# Altium schematic sheet FPGA_Decoupling.SchDoc: Sayma AMC
size 420 x 297 mm; $$Internal___BlkDate: 0:12:25_2-9-18; $$Internal_NAME_PLACEHOLDER: a3sheet; $$Internal_Resolution: 00001mm; $$NotCommonProperty_@NAME: FPGA_XCKU040FFVA1156; $$NotCommonProperty_@PRINTORDER: 24; $$NotCommonProperty_@SHEET: FPGA Decoupling; $$NotCommonProperty_@SHEETTOTAL: 30; CmpIndex: 996; Drawing Author: G.Kasprowicz; Drawing Number: Sayma AMC; Drawing Project: AMC FMC Carrier Board; Drawing Revision: 2.0; SymIndex: 2141; CheckedBy: P.Kulik,T.Przywozki,W.Ruclo; Author: G.Kasprowicz; CompanyName: WUT ISE; DrawnBy: G.Kasprowicz; Organization: WUT ISE; Address1: PW ISE; Address2: Nowowiejska 15/19 00-665 Warsaw; Address3: gkasprow@gmail.com; DocumentNumber: 30; Revision: 2; SheetNumber: 30; SheetTotal: 32; ModifiedBy: -; CheckedDate: -; Title2: FPGA Decoupling; DivGrp: WUT ISE; Designer: G.Kasprowicz; ModifiedDate: -; ProjectName: Sensor Box
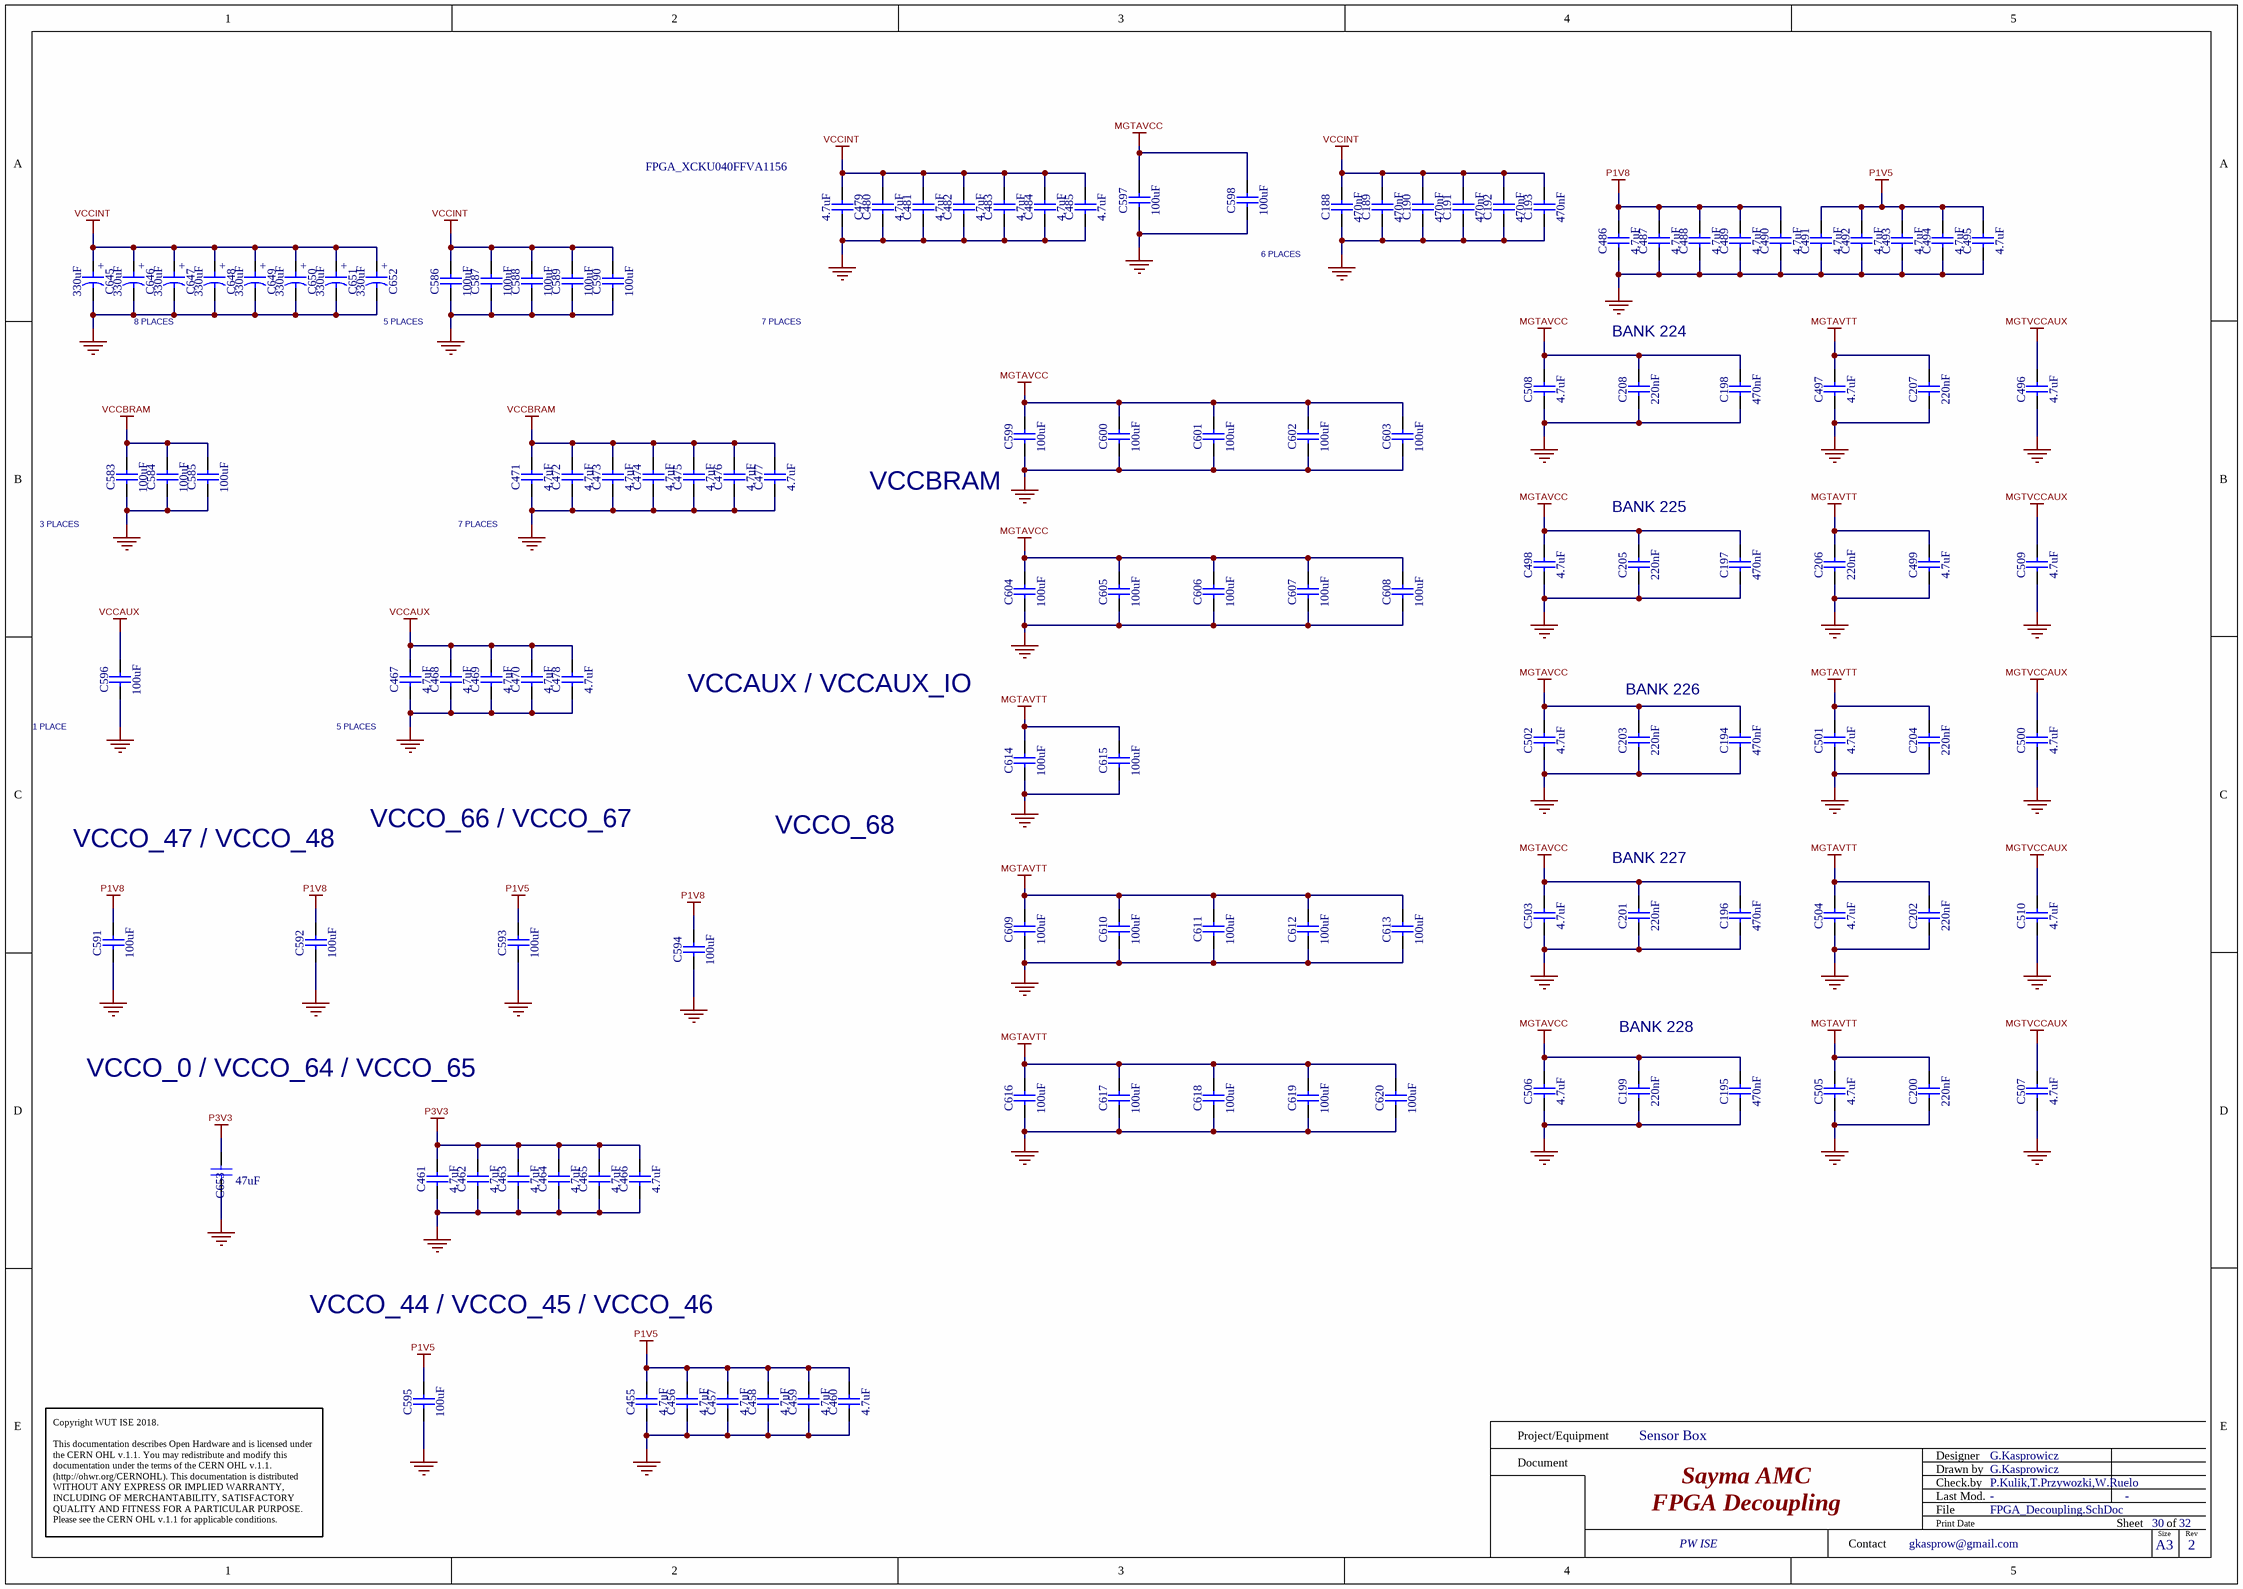
[diagram p0: FPGA_Decoupling.SchDoc]

## Parts
C188  470nF  [CAPC0603X33N]
C189  470nF  [CAPC0603X33N]
C190  470nF  [CAPC0603X33N]
C191  470nF  [CAPC0603X33N]
C192  470nF  [CAPC0603X33N]
C193  470nF  [CAPC0603X33N]
C194  470nF  [CAPC0603X33N]
C195  470nF  [CAPC0603X33N]
C196  470nF  [CAPC0603X33N]
C197  470nF  [CAPC0603X33N]
C198  470nF  [CAPC0603X33N]
C199  220nF  [CAPC0603X33N]
C200  220nF  [CAPC0603X33N]
C201  220nF  [CAPC0603X33N]
C202  220nF  [CAPC0603X33N]
C203  220nF  [CAPC0603X33N]
C204  220nF  [CAPC0603X33N]
C205  220nF  [CAPC0603X33N]
C206  220nF  [CAPC0603X33N]
C207  220nF  [CAPC0603X33N]
C208  220nF  [CAPC0603X33N]
C455  4.7uF  [CAPC1005X55N]
C456  4.7uF  [CAPC1005X55N]
C457  4.7uF  [CAPC1005X55N]
C458  4.7uF  [CAPC1005X55N]
C459  4.7uF  [CAPC1005X55N]
C460  4.7uF  [CAPC1005X55N]
C461  4.7uF  [CAPC1005X55N]
C462  4.7uF  [CAPC1005X55N]
C463  4.7uF  [CAPC1005X55N]
C464  4.7uF  [CAPC1005X55N]
C465  4.7uF  [CAPC1005X55N]
C466  4.7uF  [CAPC1005X55N]
C467  4.7uF  [CAPC1005X55N]
C468  4.7uF  [CAPC1005X55N]
C469  4.7uF  [CAPC1005X55N]
C470  4.7uF  [CAPC1005X55N]
C471  4.7uF  [CAPC1005X55N]
C472  4.7uF  [CAPC1005X55N]
C473  4.7uF  [CAPC1005X55N]
C474  4.7uF  [CAPC1005X55N]
C475  4.7uF  [CAPC1005X55N]
C476  4.7uF  [CAPC1005X55N]
C477  4.7uF  [CAPC1005X55N]
C478  4.7uF  [CAPC1005X55N]
C479  4.7uF  [CAPC1005X55N]
C480  4.7uF  [CAPC1005X55N]
C481  4.7uF  [CAPC1005X55N]
C482  4.7uF  [CAPC1005X55N]
C483  4.7uF  [CAPC1005X55N]
C484  4.7uF  [CAPC1005X55N]
C485  4.7uF  [CAPC1005X55N]
C486  4.7uF  [CAPC1005X55N]
C487  4.7uF  [CAPC1005X55N]
C488  4.7uF  [CAPC1005X55N]
C489  4.7uF  [CAPC1005X55N]
C490  4.7uF  [CAPC1005X55N]
C491  4.7uF  [CAPC1005X55N]
C492  4.7uF  [CAPC1005X55N]
C493  4.7uF  [CAPC1005X55N]
C494  4.7uF  [CAPC1005X55N]
C495  4.7uF  [CAPC1005X55N]
C496  4.7uF  [CAPC1005X55N]
C497  4.7uF  [CAPC1005X55N]
C498  4.7uF  [CAPC1005X55N]
C499  4.7uF  [CAPC1005X55N]
C500  4.7uF  [CAPC1005X55N]
C501  4.7uF  [CAPC1005X55N]
C502  4.7uF  [CAPC1005X55N]
C503  4.7uF  [CAPC1005X55N]
C504  4.7uF  [CAPC1005X55N]
C505  4.7uF  [CAPC1005X55N]
C506  4.7uF  [CAPC1005X55N]
C507  4.7uF  [CAPC1005X55N]
C508  4.7uF  [CAPC1005X55N]
C509  4.7uF  [CAPC1005X55N]
C510  4.7uF  [CAPC1005X55N]
C583  100uF  [CAPC3216X180N]
C584  100uF  [CAPC3216X180N]
C585  100uF  [CAPC3216X180N]
C586  100uF  [CAPC3216X180N]
C587  100uF  [CAPC3216X180N]
C588  100uF  [CAPC3216X180N]
C589  100uF  [CAPC3216X180N]
C590  100uF  [CAPC3216X180N]
C591  100uF  [CAPC3216X180N]
C592  100uF  [CAPC3216X180N]
C593  100uF  [CAPC3216X180N]
C594  100uF  [CAPC3216X180N]
C595  100uF  [CAPC3216X180N]
C596  100uF  [CAPC3216X180N]
C597  100uF  [CAPC3216X180N]
C598  100uF  [CAPC3216X180N]
C599  100uF  [CAPC3216X180N]
C600  100uF  [CAPC3216X180N]
C601  100uF  [CAPC3216X180N]
C602  100uF  [CAPC3216X180N]
C603  100uF  [CAPC3216X180N]
C604  100uF  [CAPC3216X180N]
C605  100uF  [CAPC3216X180N]
C606  100uF  [CAPC3216X180N]
C607  100uF  [CAPC3216X180N]
C608  100uF  [CAPC3216X180N]
C609  100uF  [CAPC3216X180N]
C610  100uF  [CAPC3216X180N]
C611  100uF  [CAPC3216X180N]
C612  100uF  [CAPC3216X180N]
C613  100uF  [CAPC3216X180N]
C614  100uF  [CAPC3216X180N]
C615  100uF  [CAPC3216X180N]
C616  100uF  [CAPC3216X180N]
C617  100uF  [CAPC3216X180N]
C618  100uF  [CAPC3216X180N]
C619  100uF  [CAPC3216X180N]
C620  100uF  [CAPC3216X180N]
C645  330uF  [CAPMP3528X210N]
C646  330uF  [CAPMP3528X210N]
C647  330uF  [CAPMP3528X210N]
C648  330uF  [CAPMP3528X210N]
C649  330uF  [CAPMP3528X210N]
C650  330uF  [CAPMP3528X210N]
C651  330uF  [CAPMP3528X210N]
C652  330uF  [CAPMP3528X210N]
C653  47uF  [CAPC3225X270N]

## Nets
GND: C188.1 C189.1 C190.1 C191.1 C192.1 C193.1 C194.1 C195.1 C196.1 C197.1 C198.1 C199.1 C200.1 C201.1 C202.1 C203.1 C204.1 C205.1 C206.1 C207.1 C208.1 C455.1 C456.1 C457.1 C458.1 C459.1 C460.1 C461.1 C462.1 C463.1 C464.1 C465.1 C466.1 C467.1 C468.1 C469.1 C470.1 C471.1 C472.1 C473.1 C474.1 C475.1 C476.1 C477.1 C478.1 C479.1 C480.1 C481.1 C482.1 C483.1 C484.1 C485.1 C486.1 C487.1 C488.1 C489.1 C490.1 C491.1 C492.1 C493.1 C494.1 C495.1 C496.1 C497.1 C498.1 C499.1 C500.1 C501.1 C502.1 C503.1 C504.1 C505.1 C506.1 C507.1 C508.1 C509.1 C510.1 C583.1 C584.1 C585.1 C586.1 C587.1 C588.1 C589.1 C590.1 C591.1 C592.1 C593.1 C594.1 C595.1 C596.1 C597.1 C598.1 C599.1 C600.1 C601.1 C602.1 C603.1 C604.1 C605.1 C606.1 C607.1 C608.1 C609.1 C610.1 C611.1 C612.1 C613.1 C614.1 C615.1 C616.1 C617.1 C618.1 C619.1 C620.1 C645.2 C646.2 C647.2 C648.2 C649.2 C650.2 C651.2 C652.2 C653.1
MGTAVCC: C194.2 C195.2 C196.2 C197.2 C198.2 C199.2 C201.2 C203.2 C205.2 C208.2 C498.2 C502.2 C503.2 C506.2 C508.2 C597.2 C598.2 C599.2 C600.2 C601.2 C602.2 C603.2 C604.2 C605.2 C606.2 C607.2 C608.2
MGTAVTT: C200.2 C202.2 C204.2 C206.2 C207.2 C497.2 C499.2 C501.2 C504.2 C505.2 C609.2 C610.2 C611.2 C612.2 C613.2 C614.2 C615.2 C616.2 C617.2 C618.2 C619.2 C620.2
MGTVCCAUX: C496.2 C500.2 C507.2 C509.2 C510.2
P1V5: C455.2 C456.2 C457.2 C458.2 C459.2 C460.2 C491.2 C492.2 C493.2 C494.2 C495.2 C593.2 C595.2
P1V8: C486.2 C487.2 C488.2 C489.2 C490.2 C591.2 C592.2 C594.2
P3V3: C461.2 C462.2 C463.2 C464.2 C465.2 C466.2 C653.2
VCCAUX: C467.2 C468.2 C469.2 C470.2 C478.2 C596.2
VCCBRAM: C471.2 C472.2 C473.2 C474.2 C475.2 C476.2 C477.2 C583.2 C584.2 C585.2
VCCINT: C188.2 C189.2 C190.2 C191.2 C192.2 C193.2 C479.2 C480.2 C481.2 C482.2 C483.2 C484.2 C485.2 C586.2 C587.2 C588.2 C589.2 C590.2 C645.1 C646.1 C647.1 C648.1 C649.1 C650.1 C651.1 C652.1

## Notes on the sheet
- 6 PLACES
- 8 PLACES
- 5 PLACES
- 7 PLACES
- (near C208) BANK 224
- 3 PLACES
- VCCBRAM
- (near C205) BANK 225
- 1 PLACE
- VCCAUX / VCCAUX_IO
- (near C203) BANK 226
- VCCO_47 / VCCO_48
- VCCO_66 / VCCO_67
- VCCO_68
- (near C201) BANK 227
- (near C199) BANK 228
- VCCO_0 / VCCO_64 / VCCO_65
- VCCO_44 / VCCO_45 / VCCO_46
- Project/Equipment
- Document
- Designer
- Drawn by
- Check.by
- Copyright WUT ISE 2018.
  This documentation describes Open Hardware and is licensed under the CERN OHL v.1.1. You may redistribute and modify this documentation under the terms of the CERN OHL v.1.1. (http://ohwr.org/CERNOHL). This documentation is distributed WITHOUT ANY EXPRESS OR IMPLIED WARRANTY, INCLUDING OF MERCHANTABILITY, SATISFACTORY QUALITY AND FITNESS FOR A PARTICULAR PURPOSE. Please see the CERN OHL v.1.1 for applicable conditions.
- Contact
- File
- Last Mod.
- Print Date
- Sheet
- Size
- A3
- of
- Rev
- (in symbol CTE3528-21_330UF_2.5V_20%_LESR0015_KEMET_T520) +

## Library data of the parts
C188-C198 = CC0201_470NF_4V_20%_X5R: Non-polarised capacitor; Manufacturer: GENERIC; Part Description: SMD Multilayer Chip Ceramic Capacitor; Manufacturer1 Part Number: AMK063BJ474MP-F; Tolerance: ±20%; Voltage: 4V; TC: X5R; Manufacturer Part Number: CC0201_470NF_4V_20%_X5R; Part Number: CC0201_470NF_4V_20%_X5R; Value: 470nF; Component Kind: Standard; Component Type: Standard; Pin Count: 2; Status: Not Recommended; Case: 0201; Mounted: Yes; Socket: No; SMD: Yes; Sense: No; Manufacturer1 Example: TAIYO YUDEN; Manufacturer1 ComponentHeight: 0.33mm; HelpURL: \\cern.ch\dfs\Applications\Altium\Datasheets\CC0201_X5R_TAIYO-YUDEN_STANDARD-CLASS2.pdf; Author: CERN DEM JLC; CreateDate: 27.05.2010; LatestRevisionDate: 27.05.2010
C199-C208 = CC0201_220NF_6.3V_20%_X5R: Non-polarised capacitor; Manufacturer: GENERIC; Part Description: SMD Multilayer Chip Ceramic Capacitor; Manufacturer1 Part Number: JMK063BJ224MP-F; Tolerance: ±20%; Voltage: 6.3V; TC: X5R; Manufacturer Part Number: CC0201_220NF_6.3V_20%_X5R; Part Number: CC0201_220NF_6.3V_20%_X5R; Value: 220nF; Component Kind: Standard; Component Type: Standard; Pin Count: 2; Status: Not Recommended; Case: 0201; Mounted: Yes; Socket: No; SMD: Yes; Sense: No; Manufacturer1 Example: TAIYO YUDEN; Manufacturer1 ComponentHeight: 0.33mm; HelpURL: \\cern.ch\dfs\Applications\Altium\Datasheets\CC0201_X5R_TAIYO-YUDEN_STANDARD-CLASS2.pdf; Author: CERN DEM JLC; CreateDate: 27.05.2010; LatestRevisionDate: 27.05.2010
C455-C510 = CC0402_4.7UF_6.3V_20%_X5R: Non-polarised capacitor; Manufacturer: GENERIC; Part Description: SMD Multilayer Chip Ceramic Capacitor; Manufacturer1 Part Number: C1005X5R0J475M050BC; Tolerance: ±20%; Voltage: 6.3V; TC: X5R; Manufacturer Part Number: CC0402_4.7UF_6.3V_20%_X5R; Part Number: CC0402_4.7UF_6.3V_20%_X5R; Value: 4.7uF; Component Kind: Standard; Component Type: Standard; Pin Count: 2; Status: Preferred; Case: 0402; Mounted: Yes; Socket: No; SMD: Yes; Sense: No; Manufacturer1 Example: TDK; Manufacturer1 ComponentHeight: 0.65mm; HelpURL: \\cern.ch\dfs\Applications\Altium\Datasheets\CC0402_X5R_TDK_C.pdf; Author: CERN DEM JLC; CreateDate: 03.03.2015; LatestRevisionDate: 03.03.2015
C583-C620 = CC1206_100UF_6.3V_20%_X5R: Non-polarised capacitor; Manufacturer: GENERIC; Part Description: SMD Multilayer Chip Ceramic Capacitor; Manufacturer1 Part Number: C1206C107M9PACTU; Tolerance: ±10%; Voltage: 6.3V; TC: X5R; Manufacturer Part Number: CC1206_100UF_6.3V_20%_X5R; Part Number: CC1206_100UF_6.3V_20%_X5R; Value: 100uF; Component Kind: Standard; Component Type: Standard; Pin Count: 2; Status: None; Case: 1206; Mounted: Yes; Socket: No; SMD: Yes; Sense: No; Manufacturer1 Example: KEMET; Manufacturer1 ComponentHeight: 1.8mm; HelpURL: \\cern.ch\dfs\Applications\Altium\Datasheets\CC1206_X5R_KEMET.pdf; Author: CERN DEM JLC; CreateDate: 26.09.2012; LatestRevisionDate: 26.09.2012
C645-C652 = CTE3528-21_330UF_2.5V_20%_LESR0015_KEMET_T520: Polarised capacitor; Manufacturer Part Number: T520B337M2R5ATE015; Manufacturer: KEMET; Part Description: Low ESR 0R015 Tantalum Chip Capacitor; Tolerance: ±20%; Voltage: 2.5V; Part Number: CTE3528-21_330UF_2.5V_20%_LESR0015_KEMET_T520; Value: 330uF; Component Kind: Standard; Component Type: Standard; Pin Count: 2; Status: None; Case: B; Mounted: Yes; Socket: No; SMD: Yes; Sense: No; ComponentHeight: 2.1mm; HelpURL: \\cern.ch\dfs\Applications\Altium\Datasheets\CTE-LESR_KEMET_T520.pdf; Author: CERN DEM JLC; CreateDate: 07.03.2012; LatestRevisionDate: 01.09.2014
C653 = CAPC3225X270N: $$NotCommonProperty_General Part Number: CC1210_47UF_6.3V_10%_X5R; $$NotCommonProperty_Manufacturer1 Example: AVX; $$NotCommonProperty_Manufacturer1 Part Number: 12106D476KAT2A; Manufacturer: GENERIC; Part Description: SMD Multilayer Chip Ceramic Capacitor; Part Name: Capacitor - non polarized CAPC3225X270N; $$Internal_Resolution: 00001mm; $$NotCommonProperty_Case: 1210; $$NotCommonProperty_Pin Count: 2; $$NotCommonProperty_SMD: Yes; $$NotCommonProperty_Status: Preferred; $$NotCommonProperty_TC: X5R; $$NotCommonProperty_Voltage: 6.3V; CmpIndex: 876; DXDB_LIBNAME: Capacitors SMD; Ref Designator: C653; SymIndex: 331; Tolerance: ±10%; Cell Name: CAPC3225X270N; Manufacturer Part Number: CC1210_47UF_6.3V_10%_X5R; Part Number: Capacitor - non polarized CAPC3225X270N; Value: 47uF; Orientation: 1 = 1